# EAGLE schematic rgb-leds-shield (EAGLE 6.5.0)
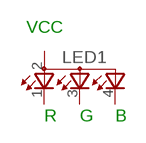
[diagram p0: schematic, sheet 1]

## Parts
LED1  TOPLED-3  [P-LCC-4-3]
Unconnected: LED1.1(CRED) LED1.2(A2) LED1.3(CBLUE) LED1.4(CGREEN)

## Notes on the sheet
- VCC
- R | G | B

## Library data of the parts
LED1 = led:TOPLED-3: OSRAM - Hyper Multi TOPLED® (RGB) LB E673, LV E673, LT E673 - Power TOPLED® Enhanced optical Power LED (HOP2000) LS E67B, LA E67B, LO E67B, LY E67B - Hyper Multi TOPLED® Enhanced optical Power LED (HOP2000 / ATON®) LATB T66B - Hyper Multi TOPLED® Hyper-Bright LED LATB T686 Source: http://www.osram.convergy.de/